# Altium schematic sheet ADC_4CH.SchDoc: Title
size 420 x 297 mm; Author: G.Kasprowicz; CompanyName: WUT ISE; DrawnBy: G.Kasprowicz; Organization: WUT ISE; Address1: PW ISE; Address2: Nowowiejska 15/19 00-665 Warsaw; Address3: gkasprow@gmail.com; Revision: 2; SheetNumber: -; SheetTotal: -; ModifiedBy: -; CheckedDate: -; Title2: Title 2; DivGrp: WUT ISE; Designer: G.Kasprowicz; ModifiedDate: -; ProjectName: Sensor Box
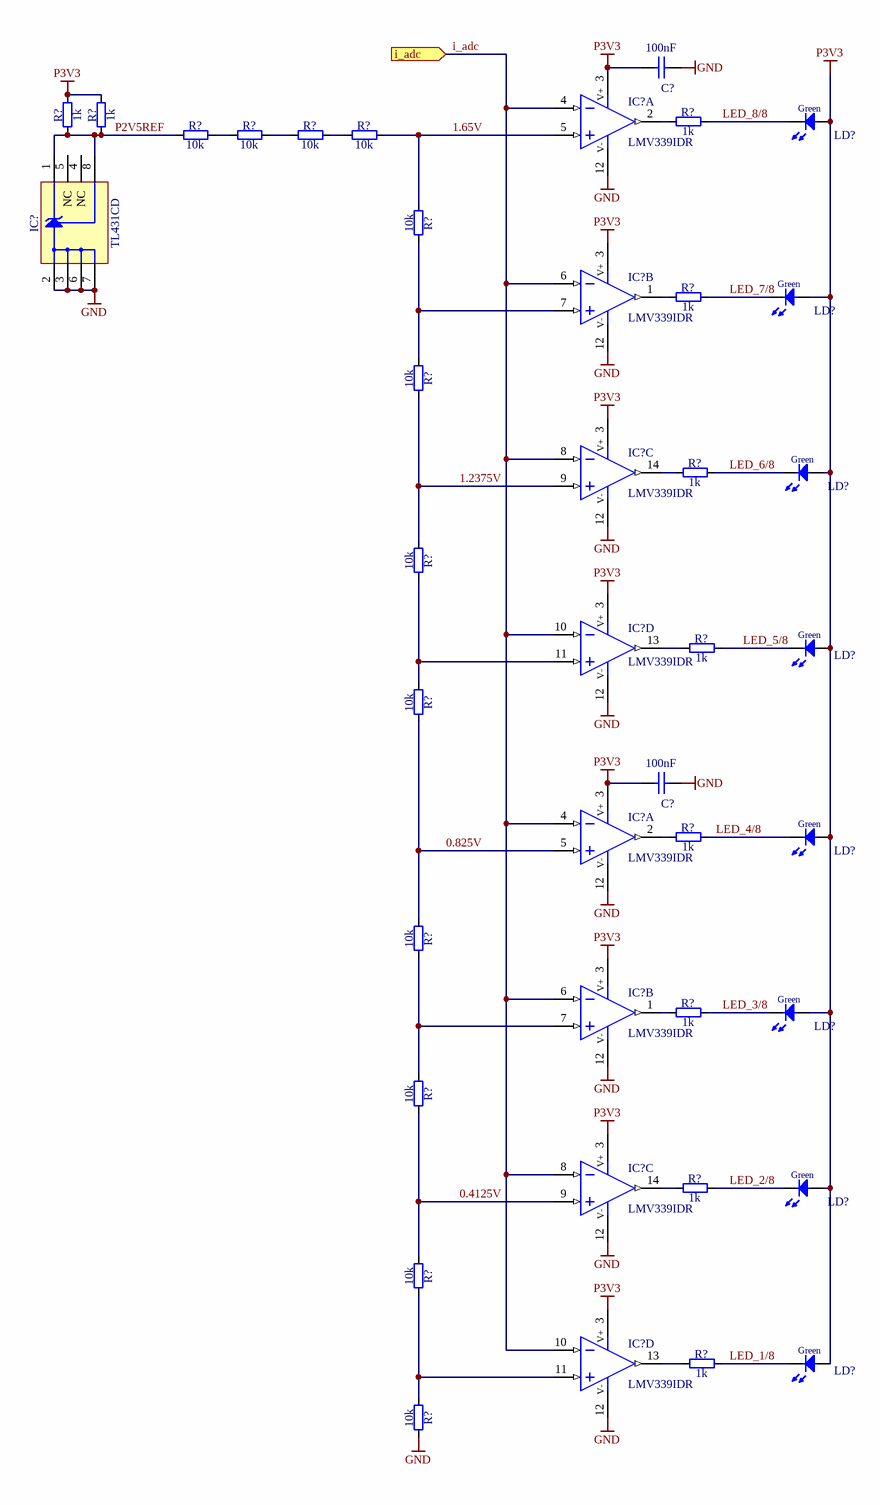
[diagram p0: ADC_4CH.SchDoc]

## Parts
(Parts that share a designator on the sheet are numbered #1, #2 ... from top to bottom, then left to right.)
C?#1  100nF  [CAPC1005X55N]
C?#2  100nF  [CAPC1005X55N]
IC?#1  LMV339IDR  [SOIC127P600X175-14N]  (part A of 4)
IC?#2  TL431CD  [SOIC127P600X175-8N]
IC?#3  LMV339IDR  [SOIC127P600X175-14N]  (part B of 4)
IC?#4  LMV339IDR  [SOIC127P600X175-14N]  (part C of 4)
IC?#5  LMV339IDR  [SOIC127P600X175-14N]  (part D of 4)
IC?#6  LMV339IDR  [SOIC127P600X175-14N]  (part A of 4)
IC?#7  LMV339IDR  [SOIC127P600X175-14N]  (part B of 4)
IC?#8  LMV339IDR  [SOIC127P600X175-14N]  (part C of 4)
IC?#9  LMV339IDR  [SOIC127P600X175-14N]  (part D of 4)
LD?#1  Green  [LED_AVAGO_HSME-C120]
LD?#2  Green  [LED_AVAGO_HSME-C120]
LD?#3  Green  [LED_AVAGO_HSME-C120]
LD?#4  Green  [LED_AVAGO_HSME-C120]
LD?#5  Green  [LED_AVAGO_HSME-C120]
LD?#6  Green  [LED_AVAGO_HSME-C120]
LD?#7  Green  [LED_AVAGO_HSME-C120]
LD?#8  Green  [LED_AVAGO_HSME-C120]
R?#1  1k  [RESC1608X55N]
R?#2  1k  [RESC1608X55N]
R?#3  1k  [RESC1608X55N]
R?#4  10k  [RESC1608X55N]
R?#5  10k  [RESC1608X55N]
R?#6  10k  [RESC1608X55N]
R?#7  10k  [RESC1608X55N]
R?#8  10k  [RESC1608X55N]
R?#9  1k  [RESC1608X55N]
R?#10  10k  [RESC1608X55N]
R?#11  1k  [RESC1608X55N]
R?#12  10k  [RESC1608X55N]
R?#13  1k  [RESC1608X55N]
R?#14  10k  [RESC1608X55N]
R?#15  1k  [RESC1608X55N]
R?#16  10k  [RESC1608X55N]
R?#17  1k  [RESC1608X55N]
R?#18  10k  [RESC1608X55N]
R?#19  1k  [RESC1608X55N]
R?#20  10k  [RESC1608X55N]
R?#21  1k  [RESC1608X55N]
R?#22  10k  [RESC1608X55N]

## Ports
i_adc (in)

## Nets
GND: C?#1.1 C?#2.1 IC?#1.12(V-) IC?#2.2(A) IC?#2.3(A) IC?#2.6(A) IC?#2.7(A) IC?#3.12(V-) IC?#4.12(V-) IC?#5.12(V-) IC?#6.12(V-) IC?#7.12(V-) IC?#8.12(V-) IC?#9.12(V-) R?#22.2
P3V3: C?#1.2 C?#2.2 IC?#1.3(V+) IC?#3.3(V+) IC?#4.3(V+) IC?#5.3(V+) IC?#6.3(V+) IC?#7.3(V+) IC?#8.3(V+) IC?#9.3(V+) LD?#1.2(A) LD?#2.2(A) LD?#3.2(A) LD?#4.2(A) LD?#5.2(A) LD?#6.2(A) LD?#7.2(A) LD?#8.2(A) R?#2.2 R?#3.2
0.825V: IC?#6.5(IN+) R?#14.2 R?#16.1
0.4125V: IC?#8.9(IN+) R?#18.2 R?#20.1
1.65V: IC?#1.5(IN+) R?#7.2 R?#8.1
1.2375V: IC?#4.9(IN+) R?#10.2 R?#12.1
i_adc: IC?#1.4(IN-) IC?#3.6(IN-) IC?#4.8(IN-) IC?#5.10(IN-) IC?#6.4(IN-) IC?#7.6(IN-) IC?#8.8(IN-) IC?#9.10(IN-) ; port i_adc
LED_1/8: LD?#8.1(C) R?#21.2
LED_2/8: LD?#7.1(C) R?#19.2
LED_3/8: LD?#6.1(C) R?#17.2
LED_4/8: LD?#5.1(C) R?#15.2
LED_5/8: LD?#4.1(C) R?#13.2
LED_6/8: LD?#3.1(C) R?#11.2
LED_7/8: LD?#2.1(C) R?#9.2
LED_8/8: LD?#1.1(C) R?#1.2
P2V5REF: IC?#2.1(C) IC?#2.8(REF) R?#2.1 R?#3.1 R?#4.1
NetIC?#1_2: IC?#1.2(OUT) R?#1.1
NetIC?#3_1: IC?#3.1(OUT) R?#9.1
NetIC?#3_7: IC?#3.7(IN+) R?#8.2 R?#10.1
NetIC?#4_14: IC?#4.14(OUT) R?#11.1
NetIC?#5_11: IC?#5.11(IN+) R?#12.2 R?#14.1
NetIC?#5_13: IC?#5.13(OUT) R?#13.1
NetIC?#6_2: IC?#6.2(OUT) R?#15.1
NetIC?#7_1: IC?#7.1(OUT) R?#17.1
NetIC?#7_7: IC?#7.7(IN+) R?#16.2 R?#18.1
NetIC?#8_14: IC?#8.14(OUT) R?#19.1
NetIC?#9_11: IC?#9.11(IN+) R?#20.2 R?#22.1
NetIC?#9_13: IC?#9.13(OUT) R?#21.1
NetR?#4_2: R?#4.2 R?#5.1
NetR?#5_2: R?#5.2 R?#6.1
NetR?#6_2: R?#6.2 R?#7.1

Not connected (* = marked no-connect by the designer): IC?#2 4(NC) 5(NC)

## Notes on the sheet
- Project/Equipment
- Document
- Designer
- Drawn by
- Check.by
- Contact
- File
- Last Mod.
- Print Date
- Sheet
- Size
- A3
- of
- Rev
- Copyright WUT 2021.
  This document describes Open Hardware and is licensed under the CERN-OHL-W v2
  You may redistribute and modify this documentation and make products using it under the terms of the CERN-OHL-W v2 (https:/cern.ch/cern-ohl). This documentation is distributed WITHOUT ANY EXPRESS OR IMPLIED WARRANTY, INCLUDING OF MERCHANTABILITY, SATISFACTORY QUALITY AND FITNESS FOR A PARTICULAR PURPOSE. Please see the CERN-OHL-W v2 for applicable conditions.
  As per CERN-OHL-W v2 section 4, should You produce hardware based
  on these sources, You must maintain the Source Location visible on the
  silkscreen or top copper for a  product you make using this documentation..

## Library data of the parts
C?#1 C?#2 = CC0402_100NF_25V_10%_X7R_YUDEN_TMK105B7104KVHF: Non-polarised capacitor; Part Description: SMD Multilayer Chip Ceramic Capacitor (High Dielectric Type) for Automotive / Industrial Applications; Manufacturer: TAIYO YUDEN; Voltage: 25V; TC: X7R; Tolerance: ±10%; Part Number: CC0402_100NF_25V_10%_X7R_YUDEN_TMK105B7104KVHF; Component Kind: Standard; Component Type: Standard; Pin Count: 2; Value: 100nF; Status: Not Recommended; Manufacturer Part Number: TMK105B7104KVHF; Case: 0402; Mounted: Yes; Socket: No; SMD: Yes; Sense: No; HelpURL: \\cern.ch\dfs\Applications\Altium\Datasheets\CC0402_TAIYO-YUDEN_TMK105B7104KVHF.pdf; Author: CERN DEM JLC; CreateDate: 10/05/2017; LatestRevisionDate: 10/05/2017; ComponentHeight: 0.55mm
IC?#1 IC?#3-IC?#9 = CMP_LMV339: Quad Differential Rail to Rail Comparator; Manufacturer: TEXAS INSTRUMENTS; PressFit: No; Bonding: No; Part Number: LMV339IDR; Component Kind: Standard; Component Type: Standard; Device: LMV339IDR; PackageDescription: SOIC 14, Pitch 1.27mm - Body 4x8.75mm, IPC Medium Density; Part Description: Quad Differential Rail to Rail Comparator; Manufacturer Part Number: LMV339IDR; Pin Count: 14; Case: SOIC14; Mounted: Yes; Socket: No; SMD: Yes; Sense: No; ComponentHeight: 1.75mm; Author: GK; HelpURL: \\cern.ch\dfs\Applications\Altium\Datasheets\LM339AD.pdf; CreateDate: 09.03.2011; LatestRevisionDate: 09.03.2011
IC?#2 = TL431CD: Precision Programmable Reference; Part Description: Vref (2.5V) To 36V 2% Precision Programmable Reference; Manufacturer: TEXAS INSTRUMENTS; PressFit: No; Bonding: No; Part Number: TL431CD; Component Kind: Standard; Component Type: Standard; Device: TL431CD; PackageDescription: SOIC 8, Pitch 1.27mm, Body 4x5mm, IPC Medium Density; Manufacturer Part Number: TL431CD; Pin Count: 8; Case: SOIC8; Mounted: Yes; Socket: No; SMD: Yes; Sense: No; ComponentHeight: 1.75mm; HelpURL: \\cern.ch\dfs\Applications\Altium\Datasheets\TL431CD.pdf; Author: CERN DEM JLC; CreateDate: 18.01.2011; LatestRevisionDate: 28.02.2011
LD?#1-LD?#8 = LED_AVAGO_HSME-C120: LED Green 1C 2A; Part Description: High Performance Right Angle Chip Green LED; Manufacturer: AVAGO TECHNOLOGIES; PressFit: No; Bonding: No; Part Number: LED_AVAGO_HSME-C120; Component Kind: Standard; Component Type: Standard; Color: Green; PackageDescription: Green Chip LED, 2-Leads, Body 1.7x1.1mm, Side Emitting Package; Manufacturer Part Number: HSME-C120; Pin Count: 2; Mounted: Yes; Socket: No; SMD: Yes; Sense: No; ComponentHeight: 0.7mm; HelpURL: \\cern.ch\dfs\Applications\Altium\Datasheets\LED_AVAGO_HSME-C120.pdf; ComponentLink1URL: \\cern.ch\dfs\Applications\Altium\Datasheets\LED_AVAGO_HSME-C110_DESIGN-GUIDE.pdf; ComponentLink1Description: Design Guide; Author: CERN DEM JMW; CreateDate: 22.07.2009; LatestRevisionDate: 20.06.2012
R?#1-R?#3 R?#9 R?#11 R?#13 R?#15 R?#17 R?#19 R?#21 = R0603_1K_1%_0.1W_100PPM: Resistor - 1%; Part Description: General Purpose Thick Film Chip Resistor; Manufacturer: GENERIC; Manufacturer1 Part Number: NRC06F1001TRF; Power: 0.1W; TC: ±100ppm/°C; PressFit: No; Part Number: R0603_1K_1%_0.1W_100PPM; Component Kind: Standard; Component Type: Standard; Pin Count: 2; Value: 1k; Status: Preferred; Tolerance: ±1%; Manufacturer Part Number: R0603_1K_1%_0.1W_100PPM; Case: 0603; Mounted: Yes; Sense: No; Socket: No; SMD: Yes; Manufacturer1 Example: NIC COMPONENT; Manufacturer1 ComponentHeight: 0.55mm; HelpURL: \\cern.ch\dfs\Applications\Altium\Datasheets\R0603_NIC_NRC.pdf; Author: CERN DEM JLC; CreateDate: 03.12.2007; LatestRevisionDate: 13.03.2008
R?#4-R?#8 R?#10 R?#12 R?#14 R?#16 R?#18 R?#20 R?#22 = R0603_10K_1%_0.1W_100PPM: Resistor - 1%; Part Description: General Purpose Thick Film Chip Resistor; Manufacturer: GENERIC; Manufacturer1 Part Number: NRC06F1002TRF; Power: 0.1W; TC: ±100ppm/°C; PressFit: No; Part Number: R0603_10K_1%_0.1W_100PPM; Component Kind: Standard; Component Type: Standard; Pin Count: 2; Value: 10k; Status: Preferred; Tolerance: ±1%; Manufacturer Part Number: R0603_10K_1%_0.1W_100PPM; Case: 0603; Mounted: Yes; Sense: No; Socket: No; SMD: Yes; Manufacturer1 Example: NIC COMPONENT; Manufacturer1 ComponentHeight: 0.55mm; HelpURL: \\cern.ch\dfs\Applications\Altium\Datasheets\R0603_NIC_NRC.pdf; Author: CERN DEM JLC; CreateDate: 03.12.2007; LatestRevisionDate: 13.03.2008